# Altium schematic sheet EDU_High-Speed-Design_LED.SchDoc: LED
size 279 x 215 mm; Date: not used; ApprovedBy: not used; CheckedBy: not used; Author: not used; DrawnBy: not used; Organization: not used; Address4: not used; SheetNumber: 10; SheetTotal: 26; Time: not used; ImagePath: not used; Application_BuildNumber: not used
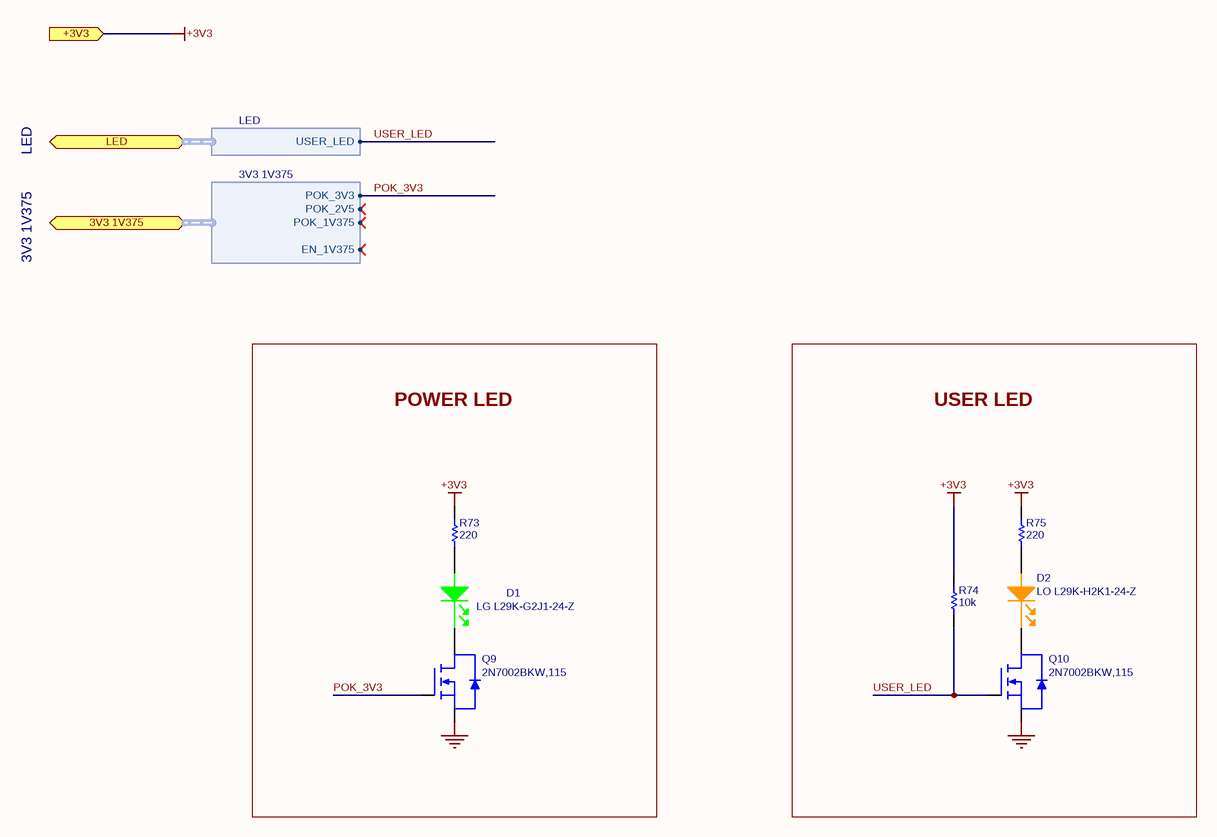
[diagram p0: EDU_High-Speed-Design_LED.SchDoc]

## Parts
D1  LG L29K-G2J1-24-Z  [LED_0603_GREEN]
D2  LO L29K-H2K1-24-Z  [LED_0603_ORANGE]
Q9  2N7002BKW,115  [SOT-23-3]
Q10  2N7002BKW,115  [SOT-23-3]
R73  220  [R0402]
R74  10k  [R0402]
R75  220  [R0402]

## Blocks framed on the sheet
POWER LED: D1 Q9 R73
USER LED: D2 Q10 R74 R75

## Ports
3V3 1V375 (bidir, harness 3V3 1V375), +3V3 (in), LED (bidir, harness LED)

## Harnesses
LED: USER_LED
3V3 1V375: POK_3V3, POK_1V375, POK_2V5, EN_1V375

## Nets
+3V3: R73.1 R74.2 R75.1 ; port +3V3
GND: Q9.2(S) Q10.2(S)
POK_3V3: Q9.1(G) ; port 3V3 1V375.POK_3V3
USER_LED: Q10.1(G) R74.1 ; port LED.USER_LED
NetD1_1: D1.1(cathode) Q9.3(D)
NetD1_2: D1.2(ANODE) R73.2
NetD2_1: D2.1(cathode) Q10.3(D)
NetD2_2: D2.2(ANODE) R75.2

## Notes on the sheet
- LED
- 3V3 1V375
- Title:
- Date:
- Size A
- Project:
- Time:
- Sheet
- Revision
- of
- Engineer:
- File:

## Library data of the parts
D1 = LG L29K-G2J1-24-Z: LED SMARTLED GREEN 570NM 0603; Manufacturer 1: OSRAM Opto Semiconductors Inc; Manufacturer Part Number 1: LG L29K-G2J1-24-Z; Supplier 1: Digi-Key; Supplier Part Number 1: 475-2709-1-ND
D2 = LO L29K-H2K1-24-Z: LED SMARTLED ORANGE 606NM 0603; Manufacturer 1: OSRAM Opto Semiconductors Inc; Supplier 1: Digi-Key; Supplier Part Number 1: 475-2740-1-ND; Manufacturer Part Number 1: LO L29K-H2K1-24-Z
Q9 Q10 = 2N7002BKW,115: MOSFET N-CH 60V 310MA SOT323; Manufacturer 1: NXP Semiconductors; Supplier 1: Digi-Key; Supplier Part Number 1: 568-5980-1-ND; Manufacturer Part Number 1: 2N7002BKW,115; ComponentLink1URL: http://www.nxp.com/documents/data_sheet/2N7002BKW.pdf; ComponentLink1Description: http://www.nxp.com/documents/data_sheet/2N7002BKW.pdf
R73 R75 = RC0402FR-07220RL: RES 220 OHM 1/16W 1% 0402 SMD; Manufacturer 1: Yageo; Manufacturer Part Number 1: RC0402FR-07220RL; Resistance: 220; Supplier 1: Digi-Key; Supplier Part Number 1: 311-220LRCT-ND; ComponentLink1URL: http://www.yageo.com/documents/recent/PYu-RC0402_51_RoHS_L_6.pdf; ComponentLink1Description: http://www.yageo.com/documents/recent/PYu-RC0402_51_RoHS_L_6.pdf
R74 = RC0402FR-0710KL: RES 10.0K OHM 1/16W 1% 0402 SMD; Manufacturer 1: Yageo; Manufacturer Part Number 1: RC0402FR-0710KL; Resistance: 10k; Supplier 1: Digi-Key; Supplier Part Number 1: 311-10.0KLRCT-ND; ComponentLink1URL: http://www.yageo.com/documents/recent/PYu-RC0402_51_RoHS_L_6.pdf; ComponentLink1Description: http://www.yageo.com/documents/recent/PYu-RC0402_51_RoHS_L_6.pdf